# Altium project H3_REF_DDR3_16X2_V1_0.PrjPcb
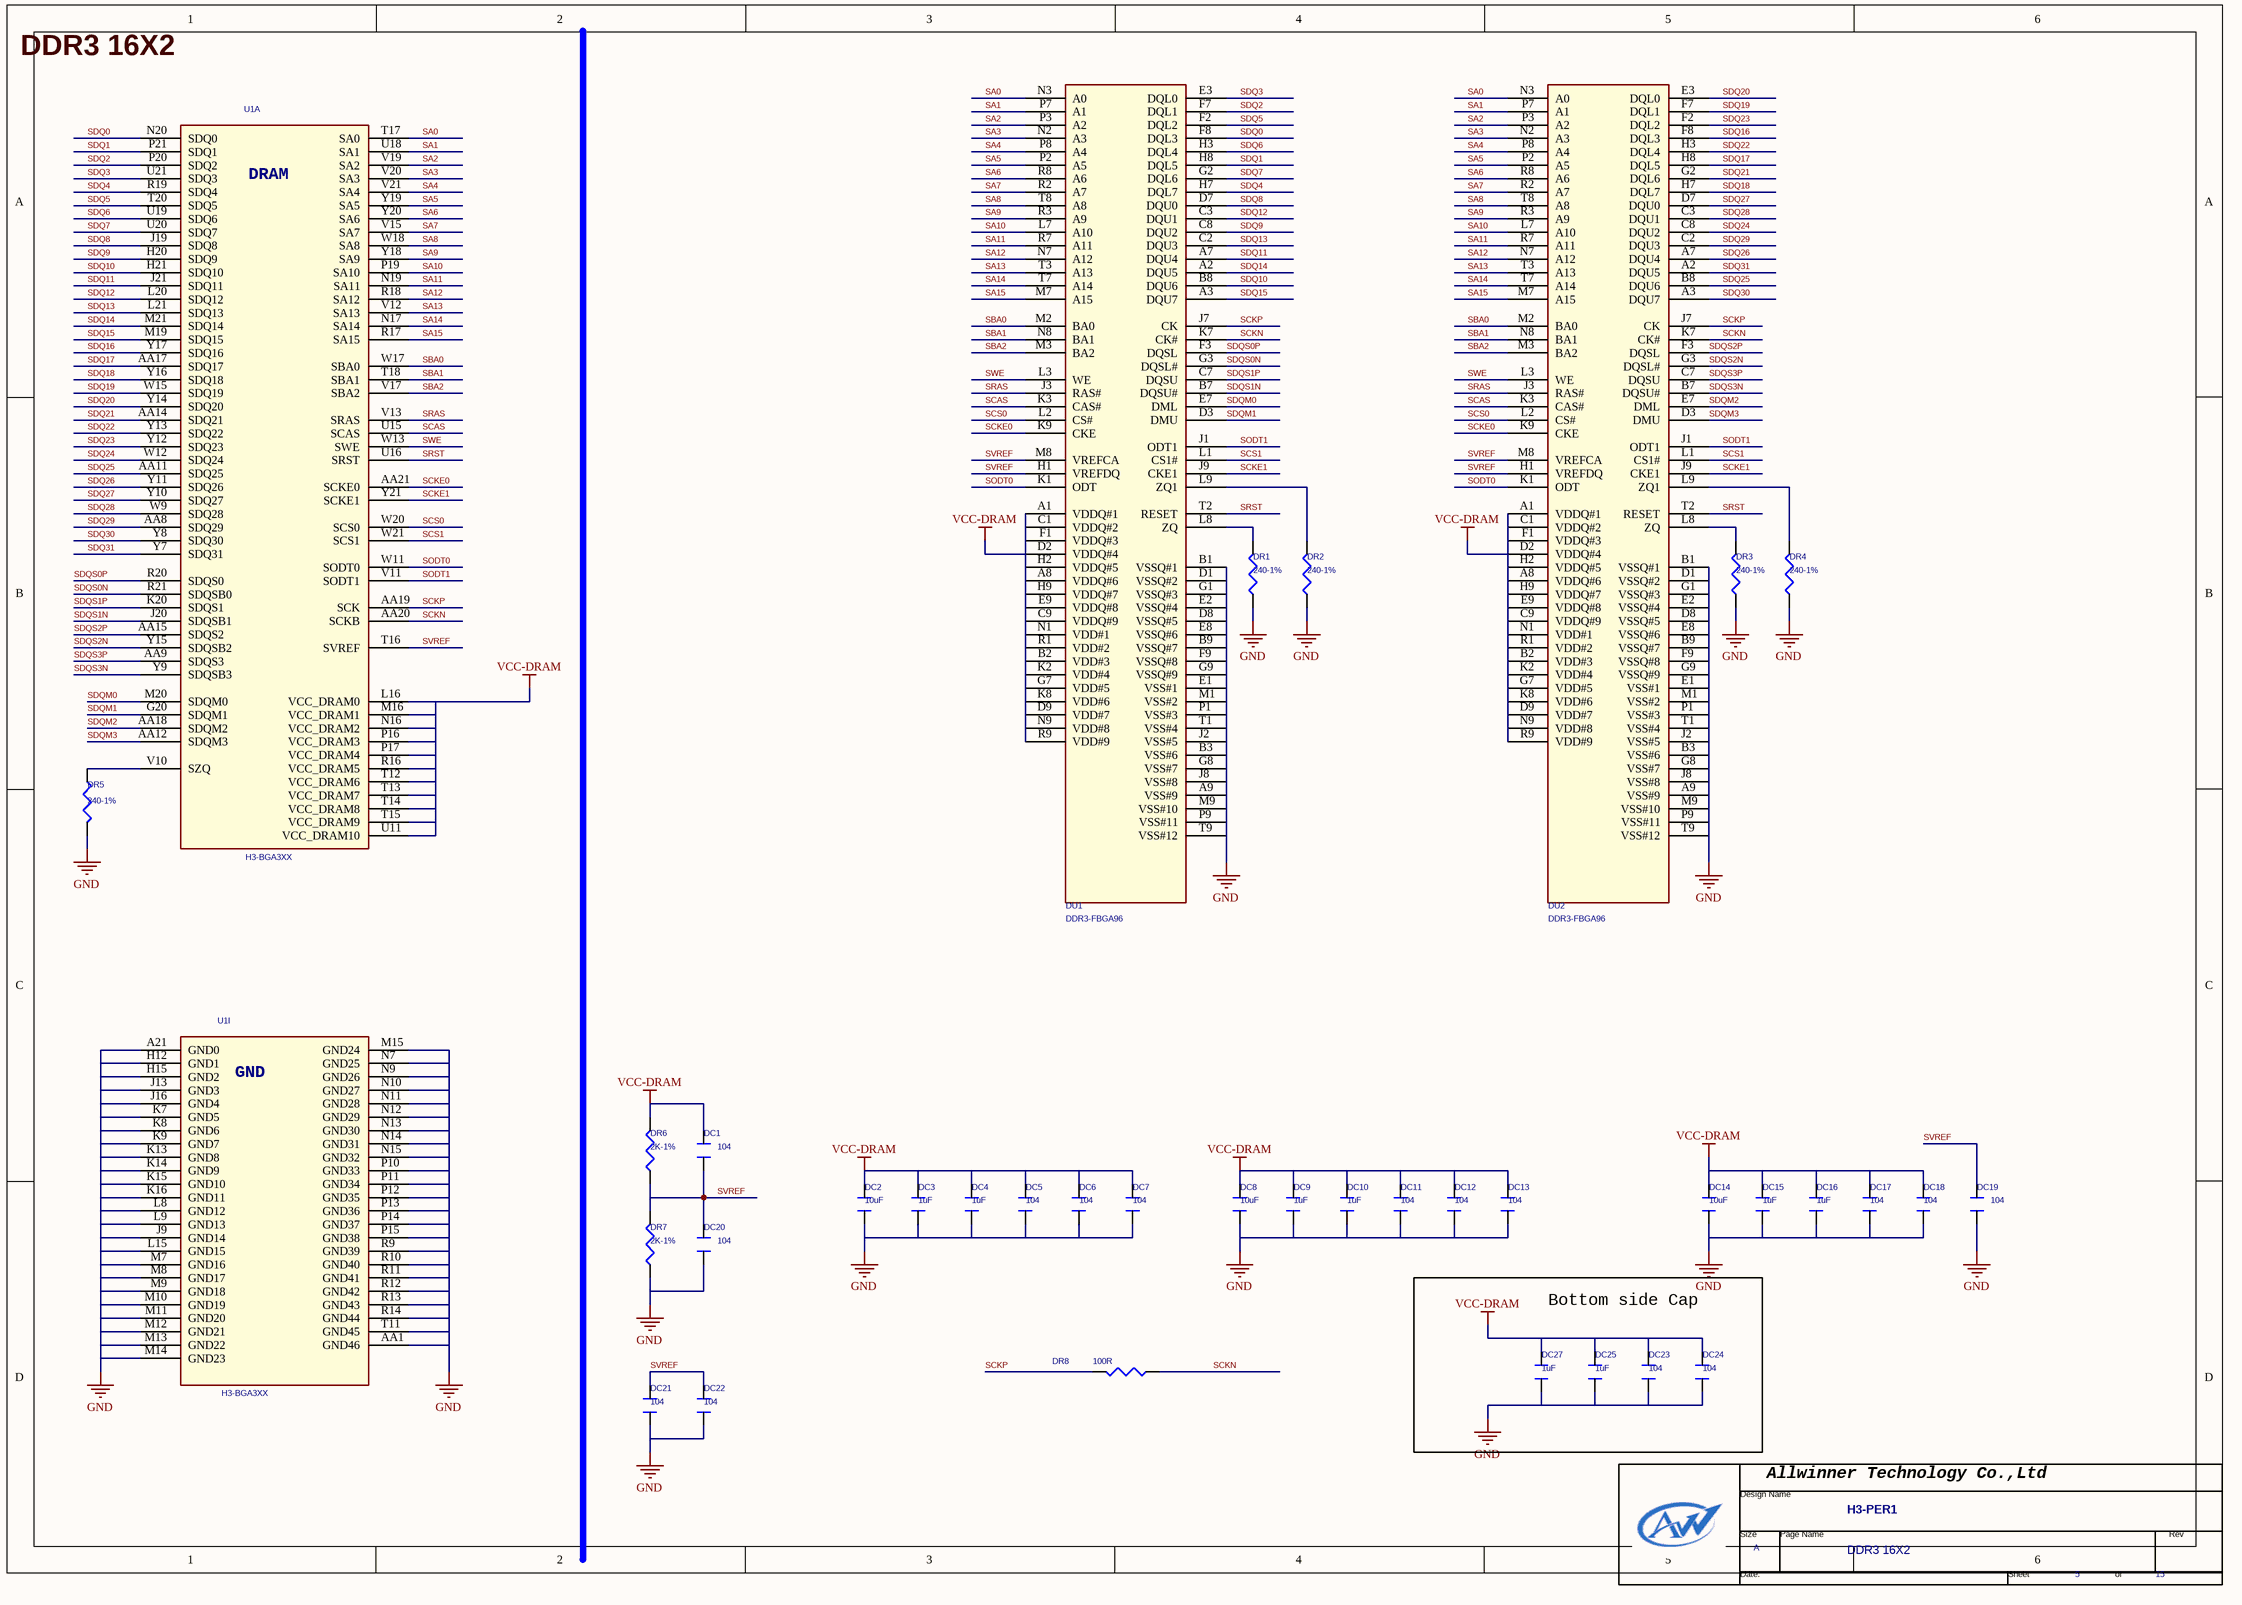
[diagram p0: 05 DDR3 16X2.SchDoc]
1 sheet, 38 parts. Net scope: global (net labels, ports and power ports of the same name join across sheets).

## Sheet 05 DDR3 16X2.SchDoc
size 420 x 297 mm

### Parts
*  Doc: DDR3 16X2  Title: H3-PER1  Page Size: A  Page Number: 5  Page Count: 15  (hidden comment: TitleBlock0-AW)  (graphical)
DC1  104  [C0402]
DC2  10uF  [C0603]
DC3  1uF  [C0402]
DC4  1uF  [C0402]
DC5  104  [C0402]
DC6  104  [C0402]
DC7  104  [C0402]
DC8  10uF  [C0603]
DC9  1uF  [C0402]
DC10  1uF  [C0402]
DC11  104  [C0402]
DC12  104  [C0402]
DC13  104  [C0402]
DC14  10uF  [C0603]
DC15  1uF  [C0402]
DC16  1uF  [C0402]
DC17  104  [C0402]
DC18  104  [C0402]
DC19  104  [C0402]
DC20  104  [C0402]
DC21  104  [C0402]
DC22  104  [C0402]
DC23  104  [C0402]
DC24  104  [C0402]
DC25  1uF  [C0402]
DC27  1uF  [C0402]
DR1  240-1%  [R0402]
DR2  240-1%  [R0402]
DR3  240-1%  [R0402]
DR4  240-1%  [R0402]
DR5  240-1%  [R0402]
DR6  2K-1%  [R0402]
DR7  2K-1%  [R0402]
DR8  100R  [R0402]
DU1  DDR3-FBGA96  [FBGA96C80P9X13]
DU2  DDR3-FBGA96  [FBGA96C80P9X13]
U1  H3-BGA3XX  [BGA347P0_65B14X14]  (parts A,I of 9)

### Blocks framed on the sheet
Bottom side Cap: DC23-DC25 DC27

### Nets
GND: DC2.1 DC3.1 DC4.1 DC5.1 DC6.1 DC7.1 DC8.1 DC9.1 DC10.1 DC11.1 DC12.1 DC13.1 DC14.1 DC15.1 DC16.1 DC17.1 DC18.1 DC19.1 DC20.1 DC21.1 DC22.1 DC23.1 DC24.1 DC25.1 DC27.1 DR1.1 DR2.1 DR3.1 DR4.1 DR5.2 DR7.1 DU1.A9(VSS#9) DU1.B1(VSSQ#1) DU1.B3(VSS#6) DU1.B9(VSSQ#7) DU1.D1(VSSQ#2) DU1.D8(VSSQ#5) DU1.E1(VSS#1) DU1.E2(VSSQ#4) DU1.E8(VSSQ#6) DU1.F9(VSSQ#8) DU1.G1(VSSQ#3) DU1.G8(VSS#7) DU1.G9(VSSQ#9) DU1.J2(VSS#5) DU1.J8(VSS#8) DU1.M1(VSS#2) DU1.M9(VSS#10) DU1.P1(VSS#3) DU1.P9(VSS#11) DU1.T1(VSS#4) DU1.T9(VSS#12) DU2.A9(VSS#9) DU2.B1(VSSQ#1) DU2.B3(VSS#6) DU2.B9(VSSQ#7) DU2.D1(VSSQ#2) DU2.D8(VSSQ#5) DU2.E1(VSS#1) DU2.E2(VSSQ#4) DU2.E8(VSSQ#6) DU2.F9(VSSQ#8) DU2.G1(VSSQ#3) DU2.G8(VSS#7) DU2.G9(VSSQ#9) DU2.J2(VSS#5) DU2.J8(VSS#8) DU2.M1(VSS#2) DU2.M9(VSS#10) DU2.P1(VSS#3) DU2.P9(VSS#11) DU2.T1(VSS#4) DU2.T9(VSS#12) U1.A21(GND0) U1.AA1(GND46) U1.H12(GND1) U1.H15(GND2) U1.J9(GND14) U1.J13(GND3) U1.J16(GND4) U1.K7(GND5) U1.K8(GND6) U1.K9(GND7) U1.K13(GND8) U1.K14(GND9) U1.K15(GND10) U1.K16(GND11) U1.L8(GND12) U1.L9(GND13) U1.L15(GND15) U1.M7(GND16) U1.M8(GND17) U1.M9(GND18) U1.M10(GND19) U1.M11(GND20) U1.M12(GND21) U1.M13(GND22) U1.M14(GND23) U1.M15(GND24) U1.N7(GND25) U1.N9(GND26) U1.N10(GND27) U1.N11(GND28) U1.N12(GND29) U1.N13(GND30) U1.N14(GND31) U1.N15(GND32) U1.P10(GND33) U1.P11(GND34) U1.P12(GND35) U1.P13(GND36) U1.P14(GND37) U1.P15(GND38) U1.R9(GND39) U1.R10(GND40) U1.R11(GND41) U1.R12(GND42) U1.R13(GND43) U1.R14(GND44) U1.T11(GND45)
VCC-DRAM: DC1.2 DC2.2 DC3.2 DC4.2 DC5.2 DC6.2 DC7.2 DC8.2 DC9.2 DC10.2 DC11.2 DC12.2 DC13.2 DC14.2 DC15.2 DC16.2 DC17.2 DC18.2 DC23.2 DC24.2 DC25.2 DC27.2 DR6.2 DU1.A1(VDDQ#1) DU1.A8(VDDQ#6) DU1.B2(VDD#3) DU1.C1(VDDQ#2) DU1.C9(VDDQ#9) DU1.D2(VDDQ#4) DU1.D9(VDD#7) DU1.E9(VDDQ#8) DU1.F1(VDDQ#3) DU1.G7(VDD#5) DU1.H2(VDDQ#5) DU1.H9(VDDQ#7) DU1.K2(VDD#4) DU1.K8(VDD#6) DU1.N1(VDD#1) DU1.N9(VDD#8) DU1.R1(VDD#2) DU1.R9(VDD#9) DU2.A1(VDDQ#1) DU2.A8(VDDQ#6) DU2.B2(VDD#3) DU2.C1(VDDQ#2) DU2.C9(VDDQ#9) DU2.D2(VDDQ#4) DU2.D9(VDD#7) DU2.E9(VDDQ#8) DU2.F1(VDDQ#3) DU2.G7(VDD#5) DU2.H2(VDDQ#5) DU2.H9(VDDQ#7) DU2.K2(VDD#4) DU2.K8(VDD#6) DU2.N1(VDD#1) DU2.N9(VDD#8) DU2.R1(VDD#2) DU2.R9(VDD#9) U1.L16(VCC_DRAM0) U1.M16(VCC_DRAM1) U1.N16(VCC_DRAM2) U1.P16(VCC_DRAM3) U1.P17(VCC_DRAM4) U1.R16(VCC_DRAM5) U1.T12(VCC_DRAM6) U1.T13(VCC_DRAM7) U1.T14(VCC_DRAM8) U1.T15(VCC_DRAM9) U1.U11(VCC_DRAM10)
SA0: DU1.N3(A0) DU2.N3(A0) U1.T17(SA0)
SA1: DU1.P7(A1) DU2.P7(A1) U1.U18(SA1)
SA2: DU1.P3(A2) DU2.P3(A2) U1.V19(SA2)
SA3: DU1.N2(A3) DU2.N2(A3) U1.V20(SA3)
SA4: DU1.P8(A4) DU2.P8(A4) U1.V21(SA4)
SA5: DU1.P2(A5) DU2.P2(A5) U1.Y19(SA5)
SA6: DU1.R8(A6) DU2.R8(A6) U1.Y20(SA6)
SA7: DU1.R2(A7) DU2.R2(A7) U1.V15(SA7)
SA8: DU1.T8(A8) DU2.T8(A8) U1.W18(SA8)
SA9: DU1.R3(A9) DU2.R3(A9) U1.Y18(SA9)
SA10: DU1.L7(A10) DU2.L7(A10) U1.P19(SA10)
SA11: DU1.R7(A11) DU2.R7(A11) U1.N19(SA11)
SA12: DU1.N7(A12) DU2.N7(A12) U1.R18(SA12)
SA13: DU1.T3(A13) DU2.T3(A13) U1.V12(SA13)
SA14: DU1.T7(A14) DU2.T7(A14) U1.N17(SA14)
SA15: DU1.M7(A15) DU2.M7(A15) U1.R17(SA15)
SBA0: DU1.M2(BA0) DU2.M2(BA0) U1.W17(SBA0)
SBA1: DU1.N8(BA1) DU2.N8(BA1) U1.T18(SBA1)
SBA2: DU1.M3(BA2) DU2.M3(BA2) U1.V17(SBA2)
SCAS: DU1.K3(CAS#) DU2.K3(CAS#) U1.U15(SCAS)
SCKE0: DU1.K9(CKE) DU2.K9(CKE) U1.AA21(SCKE0)
SCKE1: DU1.J9(CKE1) DU2.J9(CKE1) U1.Y21(SCKE1)
SCKN: DR8.1 DU1.K7(CK#) DU2.K7(CK#) U1.AA20(SCKB)
SCKP: DR8.2 DU1.J7(CK) DU2.J7(CK) U1.AA19(SCK)
SCS0: DU1.L2(CS#) DU2.L2(CS#) U1.W20(SCS0)
SCS1: DU1.L1(CS1#) DU2.L1(CS1#) U1.W21(SCS1)
SDQ0: DU1.F8(DQL3) U1.N20(SDQ0)
SDQ1: DU1.H8(DQL5) U1.P21(SDQ1)
SDQ2: DU1.F7(DQL1) U1.P20(SDQ2)
SDQ3: DU1.E3(DQL0) U1.U21(SDQ3)
SDQ4: DU1.H7(DQL7) U1.R19(SDQ4)
SDQ5: DU1.F2(DQL2) U1.T20(SDQ5)
SDQ6: DU1.H3(DQL4) U1.U19(SDQ6)
SDQ7: DU1.G2(DQL6) U1.U20(SDQ7)
SDQ8: DU1.D7(DQU0) U1.J19(SDQ8)
SDQ9: DU1.C8(DQU2) U1.H20(SDQ9)
SDQ10: DU1.B8(DQU6) U1.H21(SDQ10)
SDQ11: DU1.A7(DQU4) U1.J21(SDQ11)
SDQ12: DU1.C3(DQU1) U1.L20(SDQ12)
SDQ13: DU1.C2(DQU3) U1.L21(SDQ13)
SDQ14: DU1.A2(DQU5) U1.M21(SDQ14)
SDQ15: DU1.A3(DQU7) U1.M19(SDQ15)
SDQ16: DU2.F8(DQL3) U1.Y17(SDQ16)
SDQ17: DU2.H8(DQL5) U1.AA17(SDQ17)
SDQ18: DU2.H7(DQL7) U1.Y16(SDQ18)
SDQ19: DU2.F7(DQL1) U1.W15(SDQ19)
SDQ20: DU2.E3(DQL0) U1.Y14(SDQ20)
SDQ21: DU2.G2(DQL6) U1.AA14(SDQ21)
SDQ22: DU2.H3(DQL4) U1.Y13(SDQ22)
SDQ23: DU2.F2(DQL2) U1.Y12(SDQ23)
SDQ24: DU2.C8(DQU2) U1.W12(SDQ24)
SDQ25: DU2.B8(DQU6) U1.AA11(SDQ25)
SDQ26: DU2.A7(DQU4) U1.Y11(SDQ26)
SDQ27: DU2.D7(DQU0) U1.Y10(SDQ27)
SDQ28: DU2.C3(DQU1) U1.W9(SDQ28)
SDQ29: DU2.C2(DQU3) U1.AA8(SDQ29)
SDQ30: DU2.A3(DQU7) U1.Y8(SDQ30)
SDQ31: DU2.A2(DQU5) U1.Y7(SDQ31)
SDQM0: DU1.E7(DML) U1.M20(SDQM0)
SDQM1: DU1.D3(DMU) U1.G20(SDQM1)
SDQM2: DU2.E7(DML) U1.AA18(SDQM2)
SDQM3: DU2.D3(DMU) U1.AA12(SDQM3)
SDQS0N: DU1.G3(DQSL#) U1.R21(SDQSB0)
SDQS0P: DU1.F3(DQSL) U1.R20(SDQS0)
SDQS1N: DU1.B7(DQSU#) U1.J20(SDQSB1)
SDQS1P: DU1.C7(DQSU) U1.K20(SDQS1)
SDQS2N: DU2.G3(DQSL#) U1.Y15(SDQSB2)
SDQS2P: DU2.F3(DQSL) U1.AA15(SDQS2)
SDQS3N: DU2.B7(DQSU#) U1.Y9(SDQSB3)
SDQS3P: DU2.C7(DQSU) U1.AA9(SDQS3)
SODT0: DU1.K1(ODT) DU2.K1(ODT) U1.W11(SODT0)
SODT1: DU1.J1(ODT1) DU2.J1(ODT1) U1.V11(SODT1)
SRAS: DU1.J3(RAS#) DU2.J3(RAS#) U1.V13(SRAS)
SRST: DU1.T2(RESET) DU2.T2(RESET) U1.U16(SRST)
SVREF: DC1.1 DC19.2 DC20.2 DC21.2 DC22.2 DR6.1 DR7.2 DU1.H1(VREFDQ) DU1.M8(VREFCA) DU2.H1(VREFDQ) DU2.M8(VREFCA) U1.T16(SVREF)
SWE: DU1.L3(WE) DU2.L3(WE) U1.W13(SWE)
NetDR1_2: DR1.2 DU1.L8(ZQ)
NetDR2_2: DR2.2 DU1.L9(ZQ1)
NetDR3_2: DR3.2 DU2.L8(ZQ)
NetDR4_2: DR4.2 DU2.L9(ZQ1)
NetDR5_1: DR5.1 U1.V10(SZQ)

### Notes on the sheet
- DDR3 16X2
- (in symbol H3-BGA3XX_5, part A) DRAM
- (in symbol H3-BGA3XX_5, part I) GND
- (in symbol TitleBlock0-AW) Allwinner Technology Co.,Ltd; Design Name; Size; Page Name; Rev; Date:; Sheet; of

### Library data of the parts
DC1 DC19 DC20 = CAPACITOR_0_Dup6: PAGE: 1
DC2-DC18 DC21-DC25 DC27 = CAPACITOR_0_Dup7: PAGE: 2
DR1-DR5 DR8 = R_Dup4
DR6 DR7 = ?_0
DU1 DU2 = DDR3_1
U1 = H3-BGA3XX_5
* = TitleBlock0-AW: Page Create Date: March  8, 1995